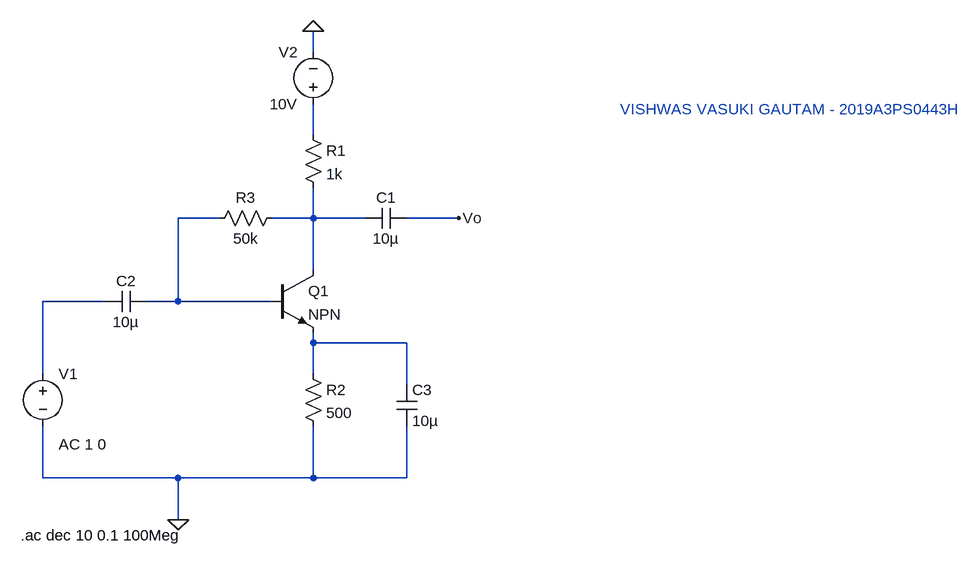
[diagram p0: schematic lab10_1.asc]
lab10_1.asc, the LTspice schematic file:
Version 4
SHEET 1 1308 680
WIRE 240 -208 240 -240
WIRE 240 -80 240 -128
WIRE 96 48 32 48
WIRE 240 48 240 0
WIRE 240 48 176 48
WIRE 320 48 240 48
WIRE 464 48 384 48
WIRE 240 128 240 48
WIRE -80 176 -176 176
WIRE 32 176 32 48
WIRE 32 176 -16 176
WIRE 176 176 32 176
WIRE 240 240 240 224
WIRE 384 240 240 240
WIRE -176 288 -176 176
WIRE 240 288 240 240
WIRE 384 304 384 240
WIRE -176 448 -176 368
WIRE 32 448 -176 448
WIRE 240 448 240 368
WIRE 240 448 32 448
WIRE 384 448 384 368
WIRE 384 448 240 448
WIRE 32 512 32 448
FLAG 240 -240 0
FLAG 32 512 0
FLAG 464 48 Vo
SYMBOL res 224 -96 R0
SYMATTR InstName R1
SYMATTR Value 1k
SYMBOL res 224 272 R0
SYMATTR InstName R2
SYMATTR Value 500
SYMBOL res 192 32 R90
WINDOW 0 0 56 VBottom 2
WINDOW 3 32 56 VTop 2
SYMATTR InstName R3
SYMATTR Value 50k
SYMBOL npn 176 128 R0
SYMATTR InstName Q1
SYMBOL cap 384 32 R90
WINDOW 0 0 32 VBottom 2
WINDOW 3 32 32 VTop 2
SYMATTR InstName C1
SYMATTR Value 10µ
SYMBOL cap -16 160 R90
WINDOW 0 0 32 VBottom 2
WINDOW 3 32 32 VTop 2
SYMATTR InstName C2
SYMATTR Value 10µ
SYMBOL voltage -176 272 R0
WINDOW 123 24 124 Left 2
WINDOW 39 0 0 Left 2
SYMATTR InstName V1
SYMATTR Value ""
SYMATTR Value2 AC 1 0
SYMBOL voltage 240 -112 R180
WINDOW 0 24 96 Left 2
WINDOW 3 24 16 Left 2
WINDOW 123 0 0 Left 2
WINDOW 39 0 0 Left 2
SYMATTR InstName V2
SYMATTR Value 10V
SYMBOL cap 368 304 R0
SYMATTR InstName C3
SYMATTR Value 10µ
TEXT 712 -120 Left 2 ;VISHWAS VASUKI GAUTAM - 2019A3PS0443H
TEXT -210 536 Left 2 !.ac dec 10 0.1 100Meg

The netlist it stands for:
* lab10_1.asc
R1 N001 N003 1k
R2 N005 0 500
R3 N003 N002 50k
Q1 N003 N002 N005 0 NPN
C1 Vo N003 10µ
C2 N002 N004 10µ
V1 N004 0 AC 1 0
V2 N001 0 10V
C3 N005 0 10µ
.model NPN NPN
.model PNP PNP
.lib standard.bjt
* VISHWAS VASUKI GAUTAM - 2019A3PS0443H
.ac dec 10 0.1 100Meg
.backanno
.end